# Altium schematic sheet Current_Voltage_Sensor.SchDoc
size A; SheetNumber: 5; SheetTotal: 6
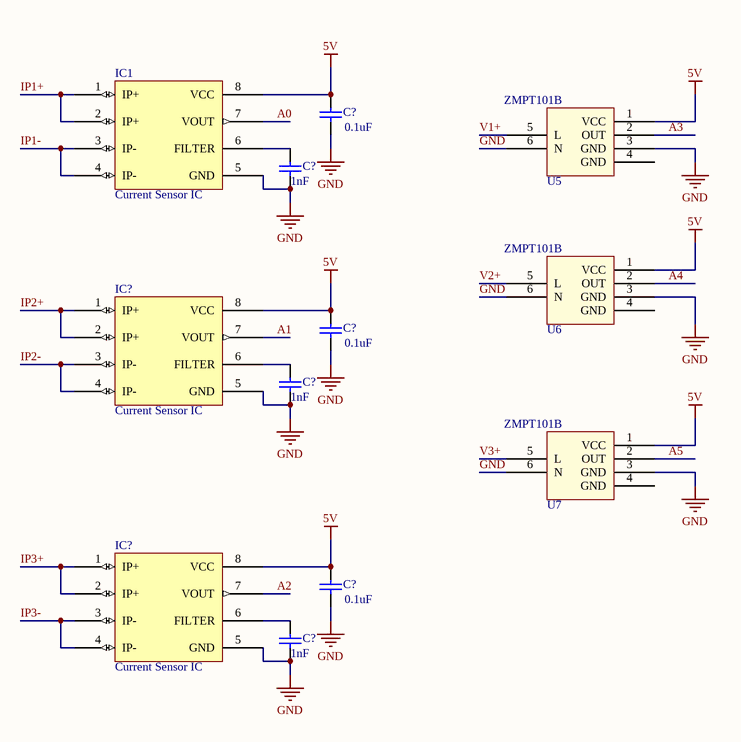
[diagram p0: Current_Voltage_Sensor.SchDoc]

## Parts
(Parts that share a designator on the sheet are numbered #1, #2 ... from top to bottom, then left to right.)
C?#1  0.1uF  [C0805]
C?#2  1nF  [C0805]
C?#3  0.1uF  [C0805]
C?#4  1nF  [C0805]
C?#5  0.1uF  [C0805]
C?#6  1nF  [C0805]
IC1  Current Sensor IC  [SO08]
IC?#1  Current Sensor IC  [SO08]
IC?#2  Current Sensor IC  [SO08]
U5  ZMPT101B  [XFMR_ZMPT101B]
U6  ZMPT101B  [XFMR_ZMPT101B]
U7  ZMPT101B  [XFMR_ZMPT101B]

## Nets
5V: C?#1.2 C?#3.2 C?#5.2 IC1.8(VCC) IC?#1.8(VCC) IC?#2.8(VCC) U5.1(VCC) U6.1(VCC) U7.1(VCC)
GND: C?#1.1 C?#2.1 C?#3.1 C?#4.1 C?#5.1 C?#6.1 IC1.5(GND) IC?#1.5(GND) IC?#2.5(GND) U5.3(GND) U5.6(N) U6.3(GND) U6.6(N) U7.3(GND) U7.6(N)
A0: IC1.7(VOUT)
A1: IC?#1.7(VOUT)
A2: IC?#2.7(VOUT)
A3: U5.2(OUT)
A4: U6.2(OUT)
A5: U7.2(OUT)
IP1+: IC1.1(IP+) IC1.2(IP+)
IP1-: IC1.3(IP-) IC1.4(IP-)
IP2+: IC?#1.1(IP+) IC?#1.2(IP+)
IP2-: IC?#1.3(IP-) IC?#1.4(IP-)
IP3+: IC?#2.1(IP+) IC?#2.2(IP+)
IP3-: IC?#2.3(IP-) IC?#2.4(IP-)
V1+: U5.5(L)
V2+: U6.5(L)
V3+: U7.5(L)
NetC?#2_2: C?#2.2 IC1.6(FILTER)
NetC?#4_2: C?#4.2 IC?#1.6(FILTER)
NetC?#6_2: C?#6.2 IC?#2.6(FILTER)

Not connected (* = marked no-connect by the designer): U5 4(GND); U6 4(GND); U7 4(GND)

## Library data of the parts
C?#1-C?#6 = CapSMD: Capacitor; Value: 33p; Published: 8-Jun-2000; LatestRevisionDate: 17-Jul-2002; LatestRevisionNote: Re-released for DXP Platform.; PackageReference: RAD-0.3; Publisher: Altium Limited
IC1 IC?#1 IC?#2 = ACS712